# EAGLE design Vjtronics (EAGLE 9.6.2)
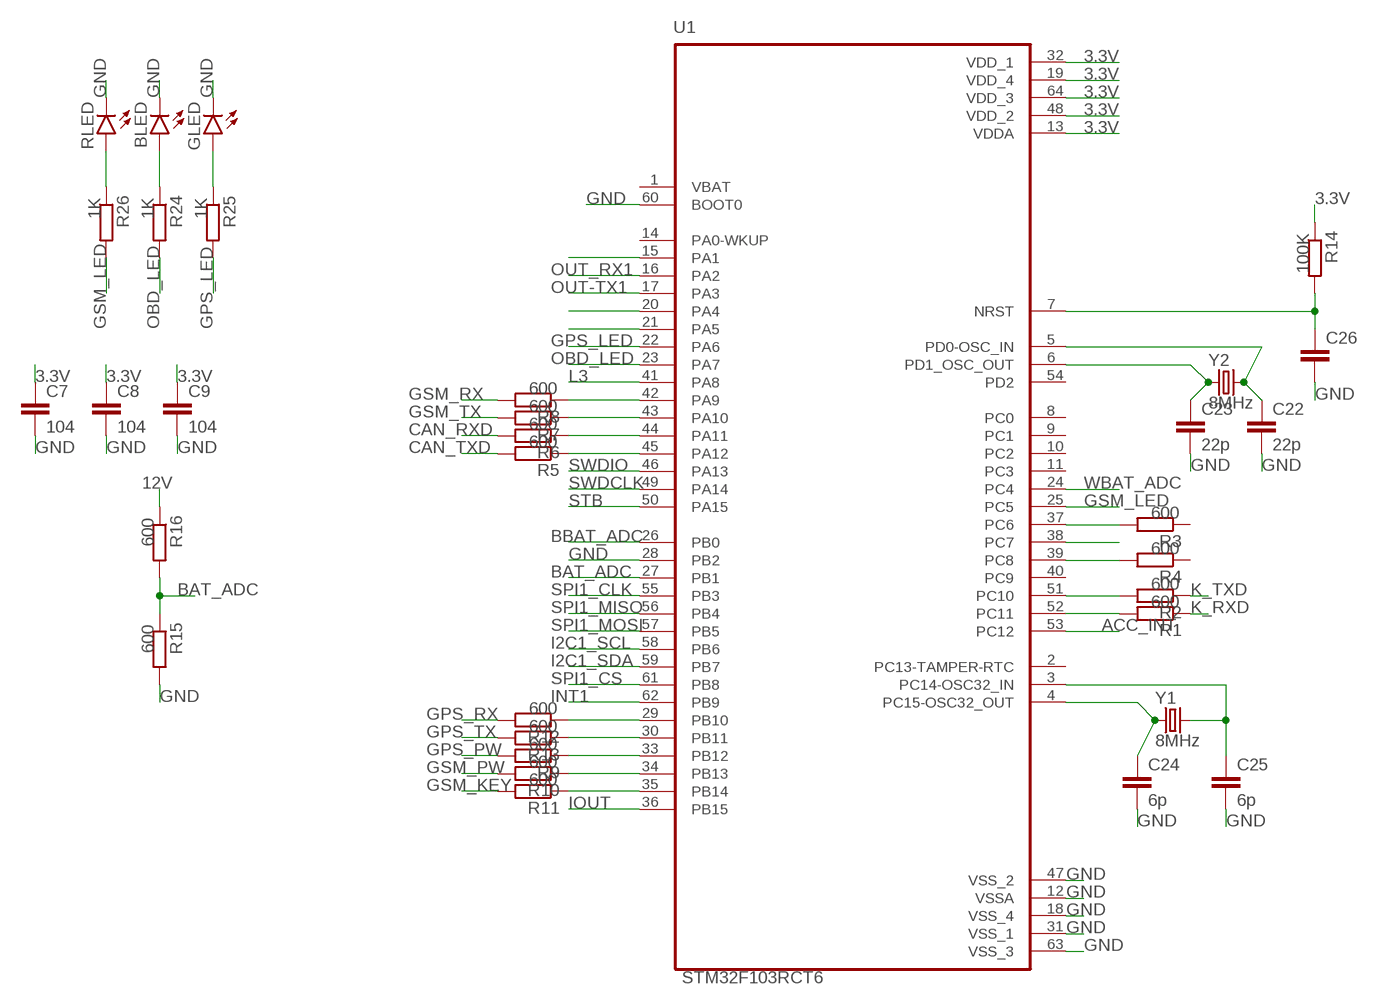
[diagram p0: schematic, sheet 1]

## Parts
BLED  LEDCHIPLED_0805  [CHIPLED_0805]
C7  104  C-EUC0805  [C0805]
C8  104  C-EUC0805  [C0805]
C9  104  C-EUC0805  [C0805]
C22  22p  C-EUC0805  [C0805]
C23  22p  C-EUC0805  [C0805]
C24  6p  C-EUC0805  [C0805]
C25  6p  C-EUC0805  [C0805]
C26  C-EUC0805  [C0805]
GLED  LEDCHIPLED_0805  [CHIPLED_0805]
R1  600  R-EU_M0805  [M0805]
R2  600  R-EU_M0805  [M0805]
R3  600  R-EU_M0805  [M0805]
R4  600  R-EU_M0805  [M0805]
R5  600  R-EU_M0805  [M0805]
R6  600  R-EU_M0805  [M0805]
R7  600  R-EU_M0805  [M0805]
R8  600  R-EU_M0805  [M0805]
R9  600  R-EU_M0805  [M0805]
R10  600  R-EU_M0805  [M0805]
R11  600  R-EU_M0805  [M0805]
R12  600  R-EU_M0805  [M0805]
R13  600  R-EU_M0805  [M0805]
R14  100K  R-EU_M0805  [M0805]
R15  600  R-EU_M0805  [M0805]
R16  600  R-EU_M0805  [M0805]
R24  1K  R-EU_M0805  [M0805]
R25  1K  R-EU_M0805  [M0805]
R26  1K  R-EU_M0805  [M0805]
RLED  LEDCHIPLED_0805  [CHIPLED_0805]
U1  STM32F103RCT6  [QFP50P1200X1200X160-64N]
Y1  8MHz  CSM-7X-DU  [CSM-7X-DU]
Y2  8MHz  CSM-7X-DU  [CSM-7X-DU]

## Nets
3.3V: C7.1 C8.1 C9.1 R14.1 U1.13(VDDA) U1.19(VDD_4) U1.32(VDD_1) U1.48(VDD_2) U1.64(VDD_3)
12V: R16.1
ACC_INT: U1.53(PC12)
BAT_ADC: R15.1 R16.2 U1.27(PB1)
BBAT_ADC: U1.26(PB0)
CAN_RXD: R6.2
CAN_TXD: R5.2
GND: BLED.C C7.2 C8.2 C9.2 C22.2 C23.2 C24.2 C25.2 C26.2 GLED.C R15.2 RLED.C U1.12(VSSA) U1.18(VSS_4) U1.28(PB2) U1.31(VSS_1) U1.47(VSS_2) U1.60(BOOT0) U1.63(VSS_3)
GPS_LED: R25.2 U1.22(PA6)
GPS_PW: R9.2
GPS_RX: R12.2
GPS_TX: R13.2
GSM_KEY: R11.2
GSM_LED: R26.2 U1.25(PC5)
GSM_PW: R10.2
GSM_RX: R8.2
GSM_TX: R7.2
I2C1_SCL: U1.58(PB6)
I2C1_SDA: U1.59(PB7)
INT1: U1.62(PB9)
IOUT: U1.36(PB15)
K_RXD: R1.1
K_TXD: R2.1
L3: U1.41(PA8)
N$1: R13.1 U1.30(PB11)
N$2: R5.1 U1.45(PA12)
N$3: R6.1 U1.44(PA11)
N$4: R7.1 U1.43(PA10)
N$5: R8.1 U1.42(PA9)
N$6: R1.2 U1.52(PC11)
N$7: R2.2 U1.51(PC10)
N$8: R12.1 U1.29(PB10)
N$9: R4.2 U1.39(PC8)
N$10: U1.38(PC7)
N$11: R3.2 U1.37(PC6)
N$12: U1.15(PA1)
N$13: R11.1 U1.35(PB14)
N$14: R10.1 U1.34(PB13)
N$15: R9.1 U1.33(PB12)
N$16: C23.1 U1.6(PD1_OSC_OUT) Y2.1
N$17: C26.1 R14.2 U1.7(NRST)
N$18: C22.1 U1.5(PD0-OSC_IN) Y2.2
N$19: C24.1 U1.4(PC15-OSC32_OUT) Y1.1
N$20: C25.1 U1.3(PC14-OSC32_IN) Y1.2
N$21: R26.1 RLED.A
N$22: U1.21(PA5)
N$23: U1.20(PA4)
N$24: BLED.A R24.1
N$25: GLED.A R25.1
OBD_LED: R24.2 U1.23(PA7)
OUT-TX1: U1.17(PA3)
OUT_RX1: U1.16(PA2)
SPI1_CLK: U1.55(PB3)
SPI1_CS: U1.61(PB8)
SPI1_MISO: U1.56(PB4)
SPI1_MOSI: U1.57(PB5)
STB: U1.50(PA15)
SWDCLK: U1.49(PA14)
SWDIO: U1.46(PA13)
WBAT_ADC: U1.24(PC4)
Unconnected: R3.1 R4.1 U1.1(VBAT) U1.2(PC13-TAMPER-RTC) U1.8(PC0) U1.9(PC1) U1.10(PC2) U1.11(PC3) U1.14(PA0-WKUP) U1.40(PC9) U1.54(PD2)

## Library data of the parts
BLED GLED RLED = led:LED: LED OSRAM: - CHIPLED LG R971, LG N971, LY N971, LG Q971, LY Q971, LO R971, LY R971 LH N974, LH R974 LS Q976, LO Q976, LY Q976 LO Q996 - Hyper CHIPLED LW Q18S LB Q993, LB Q99A, LB R99A - SideLED LS A670, LO A670, LY A670, LG A670, LP A670 LB A673, LV A673, LT A673, LW A673 LH A674 LY A675 LS A676, LA A676, LO A676, LY A676, LW A676 LS A679, LY A679, LG A679 - Hyper Micro SIDELED® LS Y876, LA Y876, LO Y876, LY Y876 LT Y87S - SmartLED LW L88C, LW L88S LB L89C, LB L89S, LG L890 LS L89K, LO L89K, LY L89K LS L896, LA L896, LO L896, LY L896 - TOPLED LS T670, LO T670, LY T670, LG T670, LP T670 LSG T670, LSP T670, LSY T670, LOP T670, LYG T670 LG T671, LOG T671, LSG T671 LB T673, LV T673, LT T673, LW T673 LH T674 LS T676, LA T676, LO T676, LY T676, LB T676, LH T676, LSB T676, LW T676 LB T67C, LV T67C, LT T67C, LS T67K, LO T67K, LY T67K, LW E67C LS E67B, LA E67B, LO E67B, LY E67B, LB E67C, LV E67C, LT E67C LW T67C LS T679, LY T679, LG T679 LS T770, LO T770, LY T770, LG T770, LP T770 LB T773, LV T773, LT T773, LW T773 LH T774 LS E675, LA E675, LY E675, LS T675 LS T776, LA T776, LO T776, LY T776, LB T776 LHGB T686 LT T68C, LB T68C - Hyper Mini TOPLED® LB M676 - Mini TOPLED Santana® LG M470 LS M47K, LO M47K, LY M47K Source: http://www.osram.convergy.de LUXEON: - LUMILED® LXK2-PW12-R00, LXK2-PW12-S00, LXK2-PW14-U00, LXK2-PW14-V00 LXK2-PM12-R00, LXK2-PM12-S00, LXK2-PM14-U00 LXK2-PE12-Q00, LXK2-PE12-R00, LXK2-PE12-S00, LXK2-PE14-T00, LXK2-PE14-U00 LXK2-PB12-K00, LXK2-PB12-L00, LXK2-PB12-M00, LXK2-PB14-N00, LXK2-PB14-P00, LXK2-PB14-Q00 LXK2-PR12-L00, LXK2-PR12-M00, LXK2-PR14-Q00, LXK2-PR14-R00 LXK2-PD12-Q00, LXK2-PD12-R00, LXK2-PD12-S00 LXK2-PH12-R00, LXK2-PH12-S00 LXK2-PL12-P00, LXK2-PL12-Q00, LXK2-PL12-R00 Source: www.luxeon.com KINGBRIGHT: KA-3528ASYC Source: www.kingbright.com
C7-C9 C22-C26 = rcl:C-EU: CAPACITOR, European symbol; SPICEPREFIX: C
R1-R16 R24-R26 = resistor:R-EU_: RESISTOR, European symbol
U1 = STM32F103RCT6:STM32F103RCT6: ARM-based 32-bit MCU Check prices <https://pricing.snapeda.com/parts/STM32F103RCT6/STMicroelectronics/view-part?ref=eda>; AVAILABILITY: Warning; DESCRIPTION: ARM® Cortex®-M3 STM32F1 Microcontroller IC 32-Bit 72MHz 256KB (256K x 8) FLASH 64-LQFP (10x10); MF: STMicroelectronics; MP: STM32F103RCT6; PACKAGE: LQFP-64 STMicroelectronics; PRICE: None; PURCHASE-URL: https://pricing.snapeda.com/search/part/STM32F103RCT6/?ref=eda
Y1 Y2 = crystal:CSM-7X-DU: SMD CRYSTAL Source: www.ecsxtal.com .. Crystal 3.6864MHz CSM_7X_DU.PDF; OC_FARNELL: unknown; OC_NEWARK: unknown

## Board
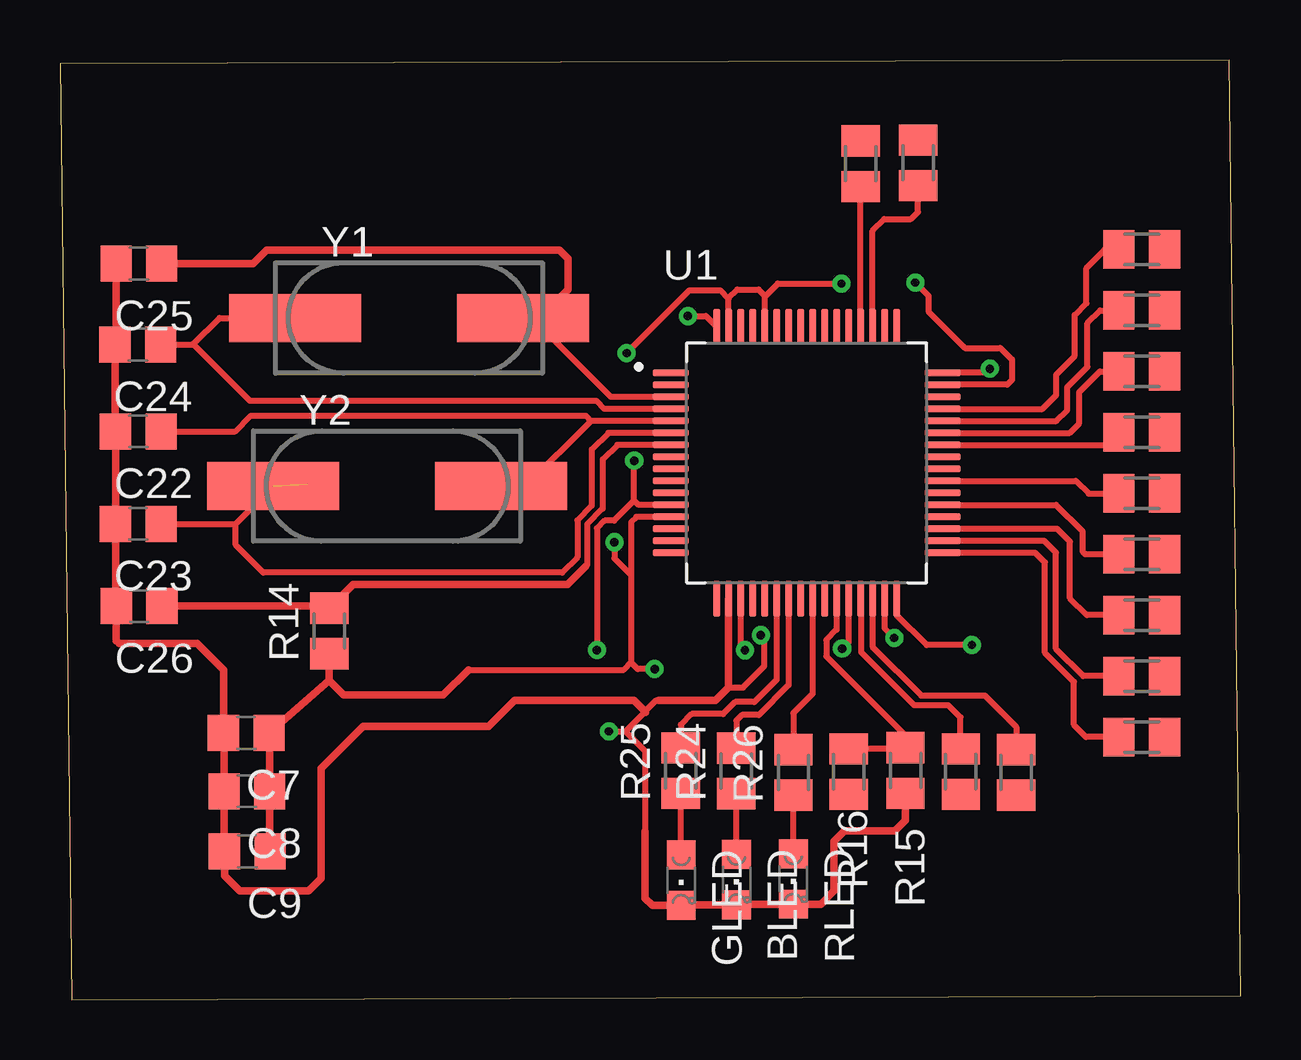
[diagram p1: board, top side]
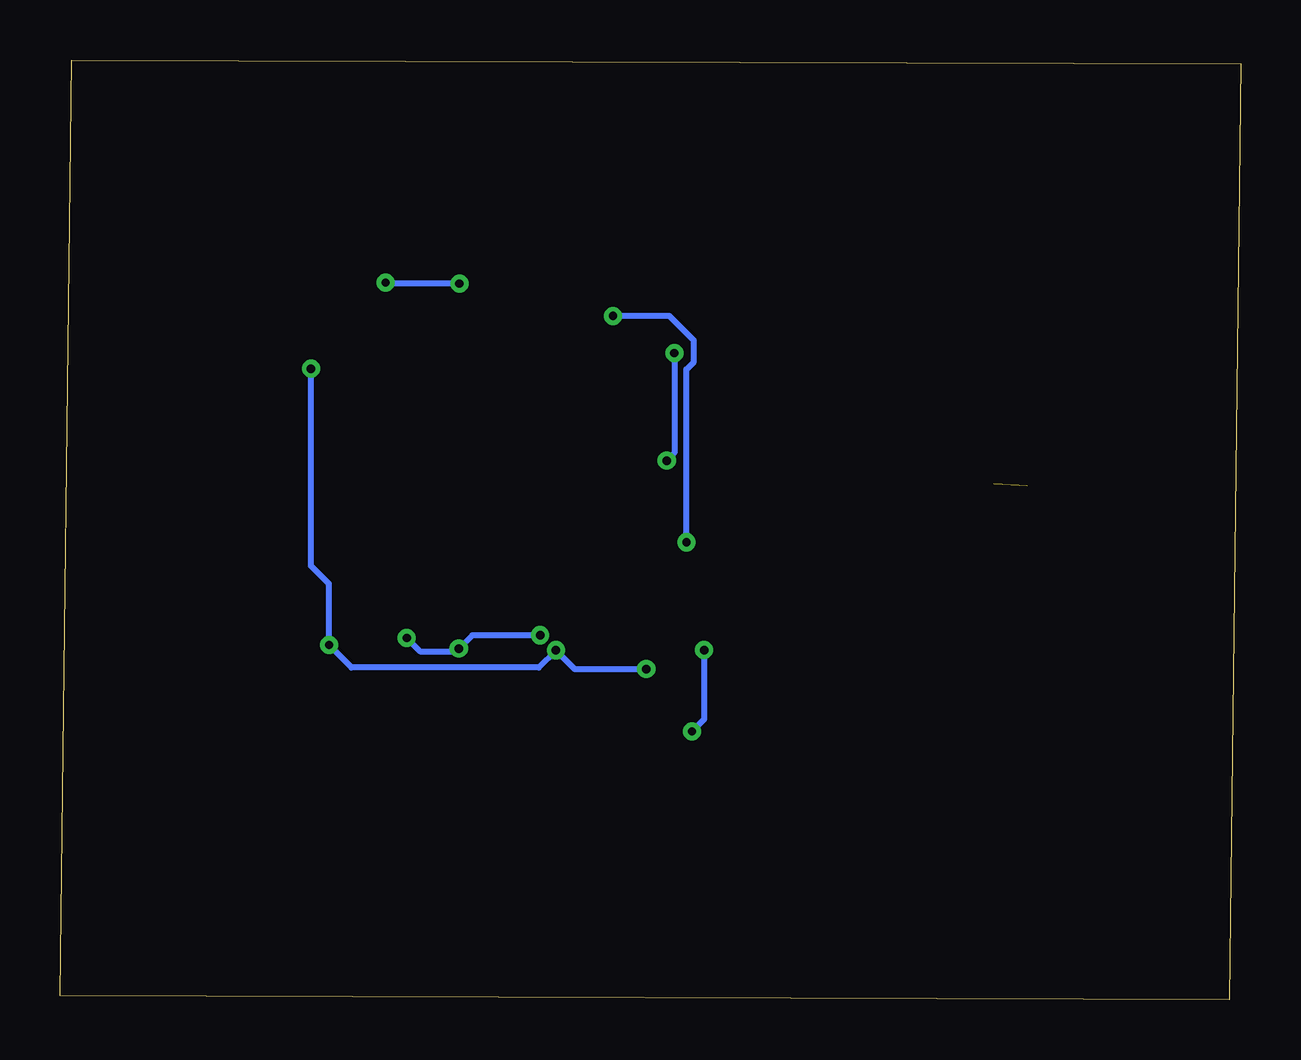
[diagram p2: board, bottom side, seen from below]

Size 49.23 x 39.18 mm. Coordinates in mm from the lower left corner, seen from the top.
Outline: 0.49,0 49.23,0.16 48.74,39.18 0,39.02 0.49,0
Copper layers (1*16): Top 0.035mm / dielectric 1.5mm / Bottom 0.035mm
Design rules "default": minimum track width 6mil, minimum drill 0.35mm, track to track 6mil, track to pad 6mil, pad to pad 6mil, via to via 6mil, smd to smd 6mil, copper to edge 40mil, drill to drill 6mil, minimum pad ring 10mil, minimum via ring 8mil, stop-mask expansion 4mil, vias tented up to drill 0mil, thermal gap 10mil

### Footprints (pad centres in the part's own frame; a part is rotated, then mirrored left to right if it is on the bottom)
CHIPLED_0805 = smd 1.2 x 1.2: A 0,-1.05; C 0,1.05
C0805 = smd 1.3 x 1.5: 1 -0.95,0; 2 0.95,0
M0805 = smd 1.3 x 1.6: 1 -0.95,0; 2 0.95,0
QFP50P1200X1200X160-64N = smd 1.49 x 0.28: 1 -5.67,3.75; 2 -5.67,3.25; 3 -5.67,2.75; 4 -5.67,2.25; 5 -5.67,1.75; 6 -5.67,1.25; 7 -5.67,0.75; 8 -5.67,0.25; 9 -5.67,-0.25; 10 -5.67,-0.75; 11 -5.67,-1.25; 12 -5.67,-1.75; 13 -5.67,-2.25; 14 -5.67,-2.75; 15 -5.67,-3.25; 16 -5.67,-3.75; 33 5.67,-3.75; 34 5.67,-3.25; 35 5.67,-2.75; 36 5.67,-2.25; 37 5.67,-1.75; 38 5.67,-1.25; 39 5.67,-0.75; 40 5.67,-0.25; 41 5.67,0.25; 42 5.67,0.75; 43 5.67,1.25; 44 5.67,1.75; 45 5.67,2.25; 46 5.67,2.75; 47 5.67,3.25; 48 5.67,3.75 | smd 0.28 x 1.49: 17 -3.75,-5.67; 18 -3.25,-5.67; 19 -2.75,-5.67; 20 -2.25,-5.67; 21 -1.75,-5.67; 22 -1.25,-5.67; 23 -0.75,-5.67; 24 -0.25,-5.67; 25 0.25,-5.67; 26 0.75,-5.67; 27 1.25,-5.67; 28 1.75,-5.67; 29 2.25,-5.67; 30 2.75,-5.67; 31 3.25,-5.67; 32 3.75,-5.67; 49 3.75,5.67; 50 3.25,5.67; 51 2.75,5.67; 52 2.25,5.67; 53 1.75,5.67; 54 1.25,5.67; 55 0.75,5.67; 56 0.25,5.67; 57 -0.25,5.67; 58 -0.75,5.67; 59 -1.25,5.67; 60 -1.75,5.67; 61 -2.25,5.67; 62 -2.75,5.67; 63 -3.25,5.67; 64 -3.75,5.67
CSM-7X-DU = smd 5.5 x 2: 1 -4.75,0; 2 4.75,0

### Placement (x,y rotation side)
BLED  28.2,5.02 180 top
C7  7.77,11.13 180 top
C8  7.79,8.7 180 top
C9  7.81,6.2 180 top
C22  3.27,23.7 180 top
C23  3.26,19.85 180 top
C24  3.24,27.32 180 top
C25  3.29,30.69 180 top
C26  3.3,16.41 180 top
GLED  25.89,5 180 top
R1  33.37,34.86 270 top
R2  35.77,34.89 270 top
R3  45.09,18.58 180 top
R4  45.09,21.12 180 top
R5  45.09,31.28 0 top
R6  45.09,28.74 0 top
R7  45.09,26.2 0 top
R8  45.09,23.66 0 top
R9  45.09,10.96 0 top
R10  45.09,13.5 0 top
R11  45.09,16.04 0 top
R12  37.55,9.52 270 top
R13  39.86,9.49 270 top
R14  11.22,15.38 90 top
R15  35.24,9.56 270 top
R16  32.88,9.51 90 top
R24  28.19,9.55 90 top
R25  25.88,9.56 90 top
R26  30.57,9.48 90 top
RLED  30.57,5.04 180 top
U1  31.12,22.39 0 top
Y1  14.56,28.43 0 top
Y2  13.65,21.42 0 top

### Tracks (layer width: path | path; a pad name or v marks a point on that pad's centre or on a via)
3.3V  (via drill 0.35)
  Top 0.254: U1.13 24.02,20.14 23.8,19.92 23.8,17.71 | 23.8,17.71 23.8,14.06 | 17.02,13.76 23.5,13.76 23.8,14.06 | U1.19 28.37,14.76 v28.55,14.57 | v24.79,13.79 24.07,13.79 23.8,14.06 | v38.01,14.8 36.13,14.8 34.87,16.05 U1.32 | v38.76,26.31 38.59,26.14 U1.48 | v26.17,28.51 26.92,28.51 U1.64 | v23.11,19.08 23.11,18.4 23.8,17.71
  Top 0.305: R14.1 11.22,13.31 | 11.22,13.31 C7.1 8.74,11.1 C8.1 8.74,6.21 C9.1 | 11.22,13.31 11.82,12.72 15.98,12.72 17.02,13.76
  Bottom 0.254: v24.79,13.79 27.77,13.79 v28.55,14.57 29.27,13.86 37.07,13.86 v38.01,14.8 38.01,17.34 38.76,18.09 v38.76,26.31 | v23.11,19.08 23.11,26.28 22.8,26.59 22.8,27.49 23.82,28.51 v26.17,28.51
BAT_ADC
  Top 0.254: R16.2 35.19,10.46 R15.1 35.24,11.02 32.29,13.98 | 32.29,13.98 32.36,13.9 | U1.27 32.36,15.44 32.37,15.43 31.94,15 31.94,14.32 32.29,13.98
GND  (via drill 0.35)
  Top 0.254: 1.99,16.45 C26.2 | U1.12 24.12,20.64 23.94,20.82 | 23.94,20.82 v23.94,22.48 | v23.62,26.96 26.24,29.58 27.52,29.58 27.87,29.23 | U1.63 27.87,29.23 | 27.87,29.23 27.87,29.25 28.23,29.62 29.12,29.62 29.37,29.37 | 29.37,29.37 U1.60 | 29.37,29.37 29.43,29.37 29.92,29.86 v32.57,29.86 | U1.47 39.49,25.65 39.68,25.84 39.68,26.69 39.2,27.18 37.72,27.18 36.2,28.7 36.2,29.35 v35.65,29.9 | U1.31 34.37,15.49 v34.77,15.09 | 27.87,13.02 28.47,13.02 29.36,13.92 29.36,15.05 v29.21,15.2 | 32.64,14.64 32.63,14.65 v32.6,14.65 32.87,14.92 U1.28 | 23.94,20.82 | v22.38,14.58 22.38,19.66 22.7,19.98 23.1,19.98 23.94,20.82 | v22.88,11.19 23.58,11.19 | 23.58,11.19 24.39,12.01 | 24.96,12.48 24.83,12.48 24.38,12.03 | 23.58,11.19 24.39,10.37 24.39,7.04
  Top 0.305: 2.02,27.36 2.2,27.34 | 2.2,27.34 C24.2 2.29,23.72 C22.2 | 1.97,23.72 C22.2 | 2,19.85 C23.2 | 6.82,8.71 C8.2 | 24.96,12.48 27.33,12.48 27.87,13.02 U1.18 | 24.38,12.03 23.92,12.48 18.95,12.48 17.86,11.39 12.63,11.39 10.88,9.65 10.88,5.07 10.36,4.55 7.48,4.55 6.86,5.17 C9.2 6.84,6.21 C8.2 | 24.38,12.03 24.39,12.01 | 24.38,12.03 24.39,12.01 | 24.39,12.01 24.41,11.99 | R15.2 35.24,7.47 34.81,7.04 32.69,7.04 32.26,6.61 32.26,4.54 31.71,3.99 RLED.C 28.22,3.99 BLED.C 25.92,3.97 GLED.C 24.69,3.95 24.39,4.24 24.39,7.04 | C25.2 2.34,27.47 2.2,27.34 | C22.2 C23.2 | C23.2 2.31,16.45 C26.2 2.35,14.97 2.46,14.86 5.71,14.86 6.82,13.76 C7.2 6.84,11.1 C8.2
  Bottom 0.254: v23.62,26.96 23.62,22.8 v23.94,22.48 | v32.57,29.86 35.61,29.86 v35.65,29.9 | v34.77,15.09 34.22,14.53 32.72,14.53 v32.6,14.65 32.05,15.2 v29.21,15.2 | v22.38,14.58 22.38,11.69 v22.88,11.19
GPS_LED
  Top 0.254: U1.22 29.87,13.34 28.95,12.42 28.15,12.42 27.65,11.92 26.32,11.92 25.88,11.47 R25.2
GSM_LED
  Top 0.254: U1.25 31.37,12.76 30.57,11.96 R26.2
N$1
  Top 0.254: U1.30 33.87,14.72 35.9,12.69 38.56,12.69 39.86,11.39 R13.1
N$2
  Top 0.254: U1.45 40.96,24.64 41.52,25.2 41.52,26.07 42.3,26.84 42.3,28.55 42.79,29.04 42.79,30.51 43.55,31.28 R5.1
N$3
  Top 0.254: U1.44 41.54,24.14 41.98,24.58 41.98,25.54 42.83,26.38 42.83,28.21 43.36,28.74 R6.1
N$4
  Top 0.254: U1.43 42.08,23.64 42.48,24.04 42.48,25.33 43.35,26.2 R7.1
N$5
  Top 0.254: U1.42 43.62,23.14 R8.1
N$6
  Top 0.254: U1.52 R1.2
N$7
  Top 0.254: U1.51 33.87,32.06 34.36,32.55 35.47,32.55 35.77,32.85 R2.2
N$8
  Top 0.254: U1.29 33.4,16.69 33.4,14.49 35.61,12.28 37.03,12.28 37.54,11.78 37.54,10.48 R12.1
N$9
  Top 0.254: U1.39 42.34,21.64 42.88,21.1 44.12,21.1 R4.2
N$11
  Top 0.254: U1.37 41.51,20.64 42.61,19.54 42.61,18.7 42.73,18.58 R3.2
N$13
  Top 0.254: R11.1 42.81,16.04 42.1,16.74 42.1,19.11 41.57,19.64 U1.35
N$14
  Top 0.254: R10.1 42.65,13.5 41.51,14.64 41.51,18.65 41.02,19.14 U1.34
N$15
  Top 0.254: R9.1 42.77,10.96 42.26,11.47 42.26,13.26 41.05,14.47 41.05,18.24 40.65,18.64 U1.33
N$16  (1 unrouted)
  Top 0.254: U1.6 22.85,23.64 22.16,22.95 22.16,20.59 21.57,19.99 21.57,18.44 20.94,17.82 8.47,17.82 7.32,18.96 7.32,19.85 | 10.92,21.5 10.92,21.51 10.3,21.51 | 8.57,20.73 Y2.1 7.32,19.85 | C23.1 7.32,19.85
N$17
  Top 0.254: U1.7 23.24,23.14 22.62,22.53 22.62,20.48 21.97,19.83 21.97,18.14 21.9,18.07
  Top 0.305: C26.1 11.14,16.41 R14.2 12.21,17.32 21.15,17.32 21.9,18.07
N$18
  Top 0.254: 19.96,21.42 19.41,21.42 | 19.41,21.42 Y2.2 | C22.1 7.31,23.7 7.96,24.35 21.92,24.35 22.13,24.14 | 22.13,24.14 19.41,21.42 | U1.5 22.13,24.14
N$19
  Top 0.254: U1.4 22.7,24.64 22.36,24.97 7.91,24.97 5.54,27.34 | C24.1 5.54,27.32 6.65,28.43 Y1.1
N$20
  Top 0.254: U1.3 22.96,25.14 19.67,28.43 Y1.2
  Top 0.305: C25.1 8.05,30.69 8.62,31.26 20.83,31.26 21.19,30.9 21.19,29.61 20,28.43 Y1.2
N$21
  Top 0.254: RLED.A R26.1
N$24
  Top 0.254: BLED.A 28.19,6.08 R24.1
N$25
  Top 0.254: R25.1 25.89,8.59 GLED.A
OBD_LED
  Top 0.254: U1.23 30.37,13.12 29.13,11.88 28.43,11.88 28.19,11.64 R24.2